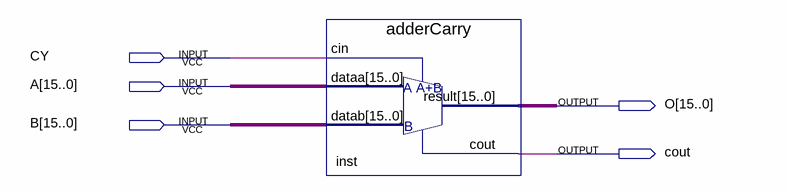
[diagram p0: schematic sheet]
// Quartus schematic amasb.bdf as structural Verilog: 1 symbols, 5 pins
module amasb (
  input  CY,
  input  [15:0] A,
  input  [15:0] B,
  output [15:0] O,
  output cout
);

  adderCarry inst (.cin(CY), .dataa(A), .datab(B), .result(O), .cout(cout));
endmodule
